# Altium schematic sheet BBB_LOGIC_IN_00.SchDoc: Logic Cape
size A3; Date: 15/01/2017; DrawnBy: Wim Van Gool; Revision: 00; SheetNumber: 1; SheetTotal: 6
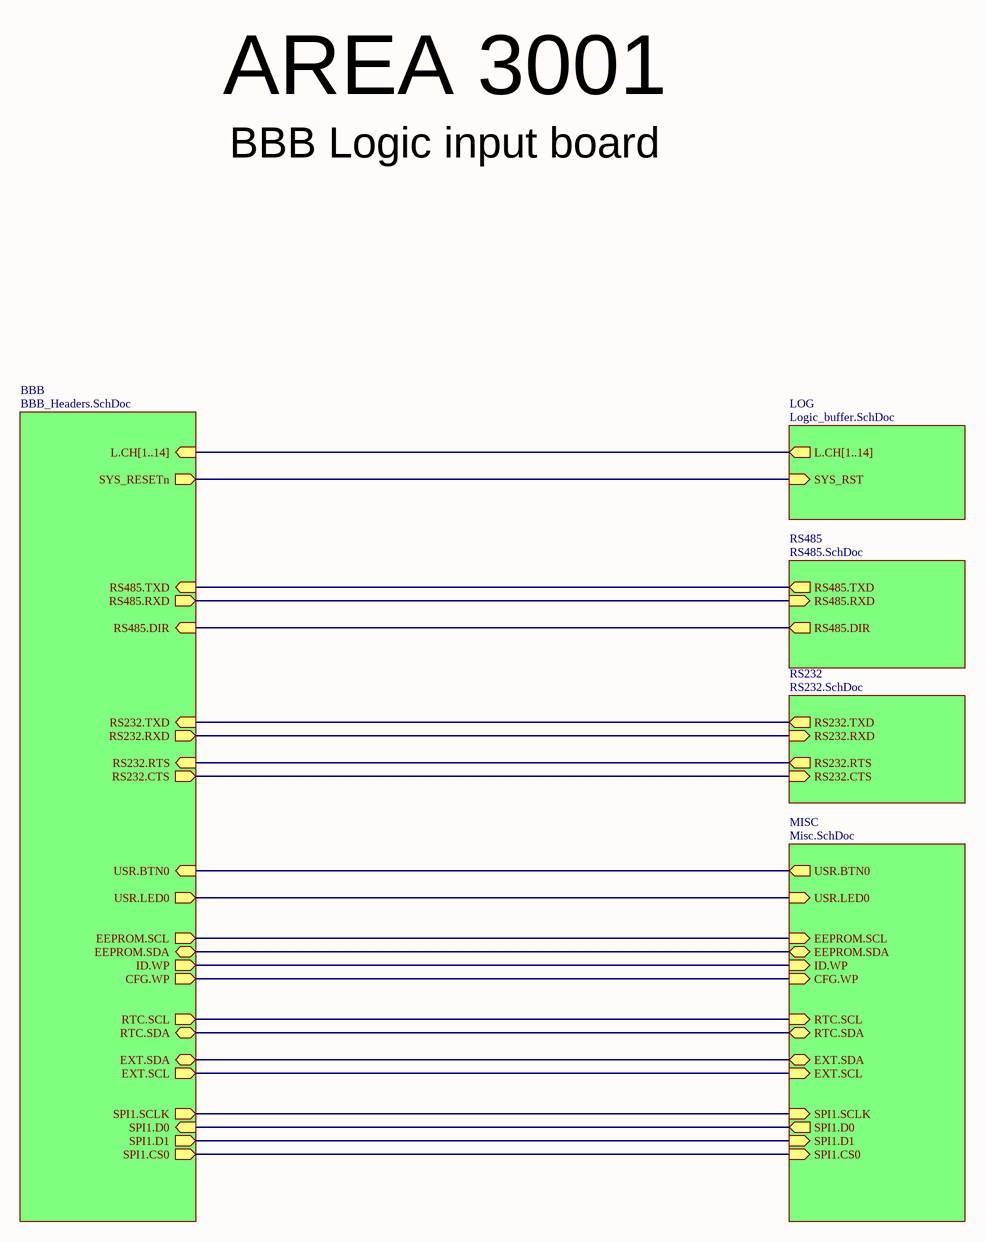
[diagram p0: BBB_LOGIC_IN_00.SchDoc]

## Sub-sheets
BBB = BBB_Headers.SchDoc: RS485.TXD (in), RS485.RXD (out), RS485.DIR (in), USR.BTN0 (in), USR.LED0 (out), EEPROM.SCL (out), EEPROM.SDA (bidir), ID.WP (out), RTC.SCL (out), RTC.SDA (bidir), CFG.WP (out), EXT.SDA (bidir), EXT.SCL (out), L.CH[1..14] (in), SYS_RESETn (out), RS232.TXD (in), RS232.RXD (out), RS232.RTS (in), RS232.CTS (out), SPI1.CS0 (out), SPI1.D1 (out), SPI1.SCLK (out), SPI1.D0 (in)
LOG = Logic_buffer.SchDoc: L.CH[1..14] (out), SYS_RST (in)
MISC = Misc.SchDoc: USR.BTN0 (out), USR.LED0 (in), RTC.SDA (bidir), EEPROM.SDA (bidir), RTC.SCL (in), EEPROM.SCL (in), CFG.WP (in), ID.WP (in), EXT.SDA (bidir), EXT.SCL (in), SPI1.SCLK (in), SPI1.D0 (out), SPI1.D1 (in), SPI1.CS0 (in)
RS232 = RS232.SchDoc: RS232.TXD (out), RS232.RXD (in), RS232.RTS (out), RS232.CTS (in)
RS485 = RS485.SchDoc: RS485.TXD (out), RS485.DIR (out), RS485.RXD (in)

## Nets
(unnamed): sheet MISC/USR.BTN0, sheet BBB/USR.BTN0
(unnamed): sheet MISC/USR.LED0, sheet BBB/USR.LED0
(unnamed): sheet MISC/RTC.SDA, sheet BBB/RTC.SDA
(unnamed): sheet MISC/EEPROM.SDA, sheet BBB/EEPROM.SDA
(unnamed): sheet MISC/RTC.SCL, sheet BBB/RTC.SCL
(unnamed): sheet MISC/EEPROM.SCL, sheet BBB/EEPROM.SCL
(unnamed): sheet MISC/CFG.WP, sheet BBB/CFG.WP
(unnamed): sheet MISC/ID.WP, sheet BBB/ID.WP
(unnamed): sheet MISC/EXT.SDA, sheet BBB/EXT.SDA
(unnamed): sheet MISC/EXT.SCL, sheet BBB/EXT.SCL
(unnamed): sheet MISC/SPI1.SCLK, sheet BBB/SPI1.SCLK
(unnamed): sheet MISC/SPI1.D0, sheet BBB/SPI1.D0
(unnamed): sheet MISC/SPI1.D1, sheet BBB/SPI1.D1
(unnamed): sheet MISC/SPI1.CS0, sheet BBB/SPI1.CS0
(unnamed): sheet RS485/RS485.TXD, sheet BBB/RS485.TXD
(unnamed): sheet RS485/RS485.DIR, sheet BBB/RS485.DIR
(unnamed): sheet RS485/RS485.RXD, sheet BBB/RS485.RXD
(unnamed): sheet BBB/SYS_RESETn, sheet LOG/SYS_RST
(unnamed): sheet BBB/RS232.TXD, sheet RS232/RS232.TXD
(unnamed): sheet BBB/RS232.RXD, sheet RS232/RS232.RXD
(unnamed): sheet BBB/RS232.RTS, sheet RS232/RS232.RTS
(unnamed): sheet BBB/RS232.CTS, sheet RS232/RS232.CTS

## Buses and harness runs
bus sheet BBB/L.CH[1..14] = sheet LOG/L.CH[1..14]

## Notes on the sheet
- AREA 3001
- BBB Logic input board
- Title
- Revision
- Date
- Dranw By
- Size
- A3
- Sheet
- of